# EAGLE design pcb_top (EAGLE 9.6.2)
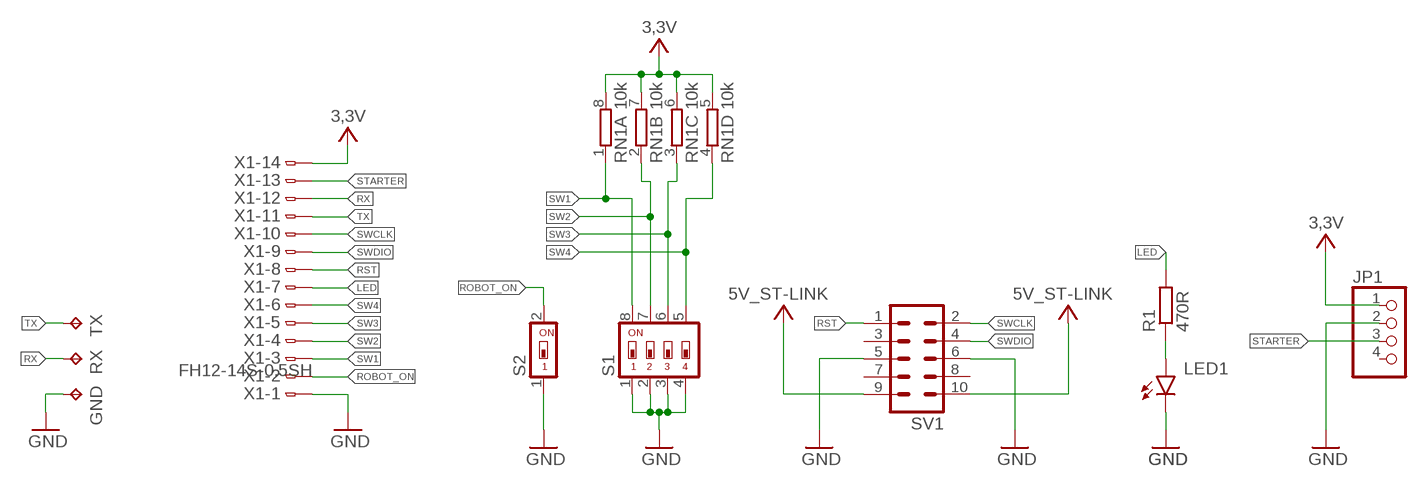
[diagram p0: schematic, sheet 1]

## Parts
GND  TPTP20SQ  [TP20SQ]
JP1  PINHD-1X4  [1X04]
LED1  LEDCHIP-LED0805  [CHIP-LED0805]
R1  470R  R-EU_R0603  [R0603]
RN1  10k  4R-NCAT16  [CAT16]
RX  TPTP20SQ  [TP20SQ]
S1  SWS004  [SMS-004]
S2  SWS001  [SMS-001]
SV1  ML10  [ML10]
TX  TPTP20SQ  [TP20SQ]
X1  FH12-14S-0.5SH  [FH12-14S-0.5SH]

## Nets
3,3V: JP1.1 RN1.5 RN1.6 RN1.7 RN1.8 X1.14 ; supply symbol labelled VCC
5V_ST-LINK: SV1.9 SV1.10 ; supply symbol labelled VCC
GND: GND.TP JP1.2 LED1.C S1.1 S1.2 S1.3 S1.4 S2.1 SV1.5 SV1.6 X1.1
LED: R1.2 X1.7
N$1: LED1.A R1.1
ROBOT_ON: S2.2 X1.2
RST: SV1.1 X1.8
RX: RX.TP X1.12
STARTER: JP1.3 X1.13
SW1: RN1.1 S1.8 X1.3
SW2: RN1.2 S1.7 X1.4
SW3: RN1.3 S1.6 X1.5
SW4: RN1.4 S1.5 X1.6
SWCLK: SV1.2 X1.10
SWDIO: SV1.4 X1.9
TX: TX.TP X1.11
Unconnected: JP1.4 SV1.3 SV1.7 SV1.8

## Library data of the parts
GND RX TX = testpad:TP: Test pad
JP1 = pinhead:PINHD-1X4: PIN HEADER
LED1 = led:LED: LED OSRAM: - CHIPLED LG R971, LG N971, LY N971, LG Q971, LY Q971, LO R971, LY R971 LH N974, LH R974 LS Q976, LO Q976, LY Q976 LO Q996 - Hyper CHIPLED LW Q18S LB Q993, LB Q99A, LB R99A - SideLED LS A670, LO A670, LY A670, LG A670, LP A670 LB A673, LV A673, LT A673, LW A673 LH A674 LY A675 LS A676, LA A676, LO A676, LY A676, LW A676 LS A679, LY A679, LG A679 - Hyper Micro SIDELED® LS Y876, LA Y876, LO Y876, LY Y876 LT Y87S - SmartLED LW L88C, LW L88S LB L89C, LB L89S, LG L890 LS L89K, LO L89K, LY L89K LS L896, LA L896, LO L896, LY L896 - TOPLED LS T670, LO T670, LY T670, LG T670, LP T670 LSG T670, LSP T670, LSY T670, LOP T670, LYG T670 LG T671, LOG T671, LSG T671 LB T673, LV T673, LT T673, LW T673 LH T674 LS T676, LA T676, LO T676, LY T676, LB T676, LH T676, LSB T676, LW T676 LB T67C, LV T67C, LT T67C, LS T67K, LO T67K, LY T67K, LW E67C LS E67B, LA E67B, LO E67B, LY E67B, LB E67C, LV E67C, LT E67C LW T67C LS T679, LY T679, LG T679 LS T770, LO T770, LY T770, LG T770, LP T770 LB T773, LV T773, LT T773, LW T773 LH T774 LS E675, LA E675, LY E675, LS T675 LS T776, LA T776, LO T776, LY T776, LB T776 LHGB T686 LT T68C, LB T68C - Hyper Mini TOPLED® LB M676 - Mini TOPLED Santana® LG M470 LS M47K, LO M47K, LY M47K Source: http://www.osram.convergy.de LUXEON: - LUMILED® LXK2-PW12-R00, LXK2-PW12-S00, LXK2-PW14-U00, LXK2-PW14-V00 LXK2-PM12-R00, LXK2-PM12-S00, LXK2-PM14-U00 LXK2-PE12-Q00, LXK2-PE12-R00, LXK2-PE12-S00, LXK2-PE14-T00, LXK2-PE14-U00 LXK2-PB12-K00, LXK2-PB12-L00, LXK2-PB12-M00, LXK2-PB14-N00, LXK2-PB14-P00, LXK2-PB14-Q00 LXK2-PR12-L00, LXK2-PR12-M00, LXK2-PR14-Q00, LXK2-PR14-R00 LXK2-PD12-Q00, LXK2-PD12-R00, LXK2-PD12-S00 LXK2-PH12-R00, LXK2-PH12-S00 LXK2-PL12-P00, LXK2-PL12-Q00, LXK2-PL12-R00 Source: www.luxeon.com KINGBRIGHT: KA-3528ASYC Source: www.kingbright.com
R1 = rcl:R-EU_: RESISTOR, European symbol; SPICEPREFIX: R
RN1 = resistor-dil:4R-N: Array Chip Resistor Source: RS Component / Phycomp; OC_FARNELL: unknown; OC_NEWARK: unknown
S1 = smd-special:SWS004: SMD Dip Switch 4 pol.
S2 = smd-special:SWS001: SMD Dip Switch 1 pol.
SV1 = con-harting-ml:ML10: HARTING; OC_FARNELL: unknown; OC_NEWARK: unknown
X1 = con-hirose:FH12-14S-0.5S: 0.5mm Pitch Connectors For FPC/FFC Source: Data sheet <http://www.hirose.co.jp/cataloge_hp/e58605370.pdf>; MPN: MC34827; OC_FARNELL: 1324544; OC_NEWARK: 41P0493

## Board
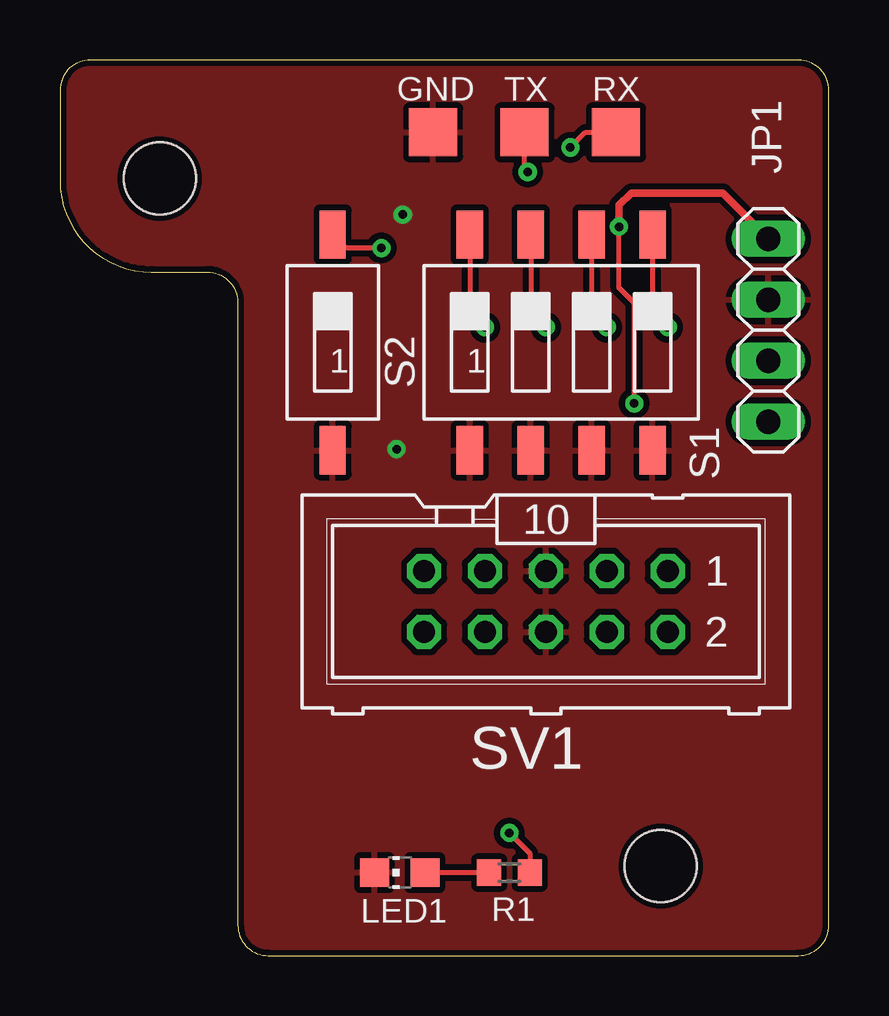
[diagram p1: board, top side]
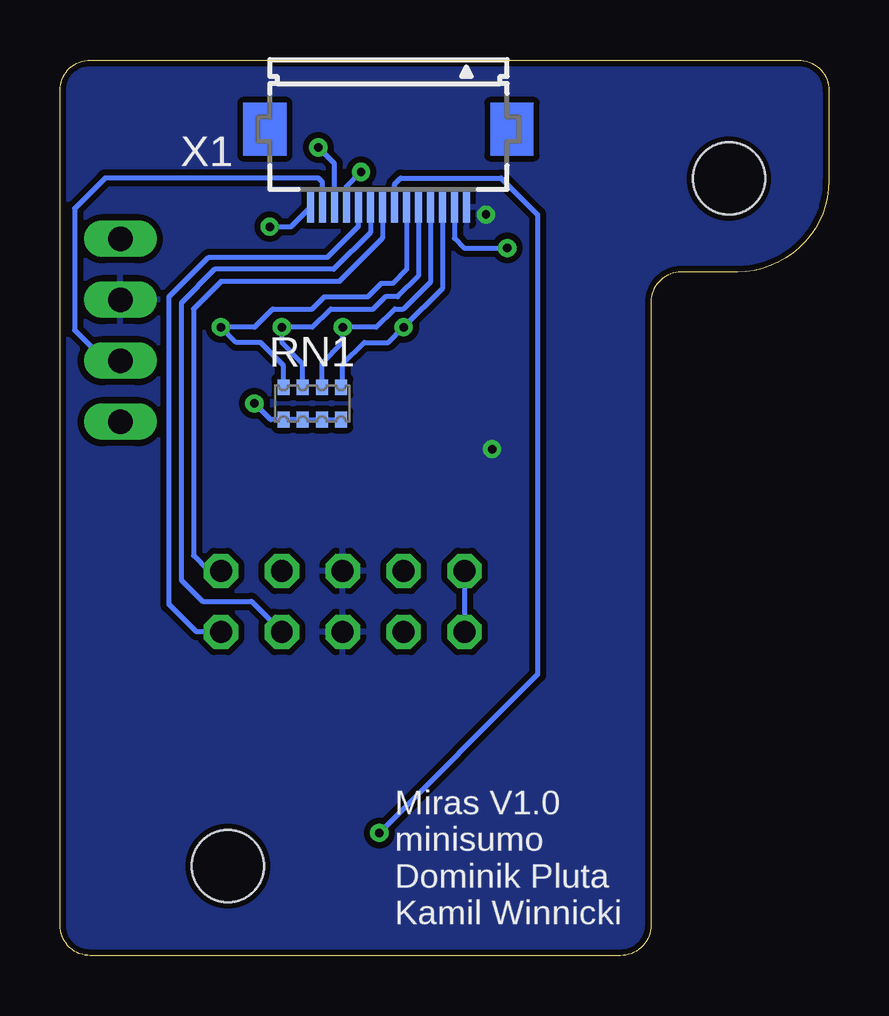
[diagram p2: board, bottom side, seen from below]

Size 32.05 x 37.34 mm. Coordinates in mm from the lower left corner, seen from the top.
Outline: 7.41,27.23 7.41,1.27 arc90 8.68,0 30.78,0 arc90 32.05,1.27 32.05,36.07 arc90 30.78,37.34 1.27,37.34 arc90 0,36.07 0,32.31 arc90 3.81,28.5 6.14,28.5 arc-90 7.41,27.23
Copper layers (1*16): Top 0.035mm / dielectric 1.5mm / Bottom 0.035mm
Design rules "default *": minimum track width 6mil, minimum drill 0.35mm, track to track 6mil, track to pad 6mil, pad to pad 6mil, via to via 6mil, smd to smd 6mil, copper to edge 1mil, drill to drill 6mil, minimum pad ring 10mil, minimum via ring 8mil, stop-mask expansion 4mil, vias tented up to drill 14mil, thermal gap 10mil
Holes 3 mm at 25.05,3.73 4.16,32.39
tKeepout: area 22,0.7 to 28,6.7; area 1.1,29.4 to 7.1,35.4

### Footprints (pad centres in the part's own frame; a part is rotated, then mirrored left to right if it is on the bottom)
TP20SQ = smd 2 x 2: TP 0,0
1X04 = drill 1.016 long: 1 -3.81,0; 2 -1.27,0; 3 1.27,0; 4 3.81,0
CHIP-LED0805 = smd 1.2 x 1.2: A 0,-1.05; C 0,1.05
R0603 = smd 1 x 1.1: 1 -0.85,0; 2 0.85,0
CAT16 = smd 0.5 x 0.65: 1 -1.2,-0.675; 2 -0.4,-0.675; 3 0.4,-0.675; 4 1.2,-0.675; 5 1.2,0.675; 6 0.4,0.675; 7 -0.4,0.675; 8 -1.2,0.675
SMS-004 = smd 1.092 x 2.007: 1 -3.81,-4.496; 2 -1.27,-4.496; 3 1.27,-4.496; 4 3.81,-4.496; 5 3.81,4.496; 6 1.27,4.496; 7 -1.27,4.496; 8 -3.81,4.496
SMS-001 = smd 1.092 x 2.007: 1 0,-4.496; 2 0,4.496
ML10 = drill 0.914 octagon: 1 -5.08,-1.27; 2 -5.08,1.27; 3 -2.54,-1.27; 4 -2.54,1.27; 5 0,-1.27; 6 0,1.27; 7 2.54,-1.27; 8 2.54,1.27; 9 5.08,-1.27; 10 5.08,1.27
FH12-14S-0.5SH = smd 0.3 x 1.3: 1 -3.25,3.25; 2 -2.75,3.25; 3 -2.25,3.25; 4 -1.75,3.25; 5 -1.25,3.25; 6 -0.75,3.25; 7 -0.25,3.25; 8 0.25,3.25; 9 0.75,3.25; 10 1.25,3.25; 11 1.75,3.25; 12 2.25,3.25; 13 2.75,3.25; 14 3.25,3.25

### Placement (x,y rotation side)
GND  15.56,34.32 0 top
JP1  29.53,26.07 270 top
LED1  14.16,3.46 90 top
R1  18.74,3.46 0 top
RN1  21.53,23.02 180 bottom
RX  23.18,34.32 0 top
S1  20.89,25.56 0 top
S2  11.37,25.56 0 top
SV1  20.26,14.76 180 top
TX  19.37,34.32 0 top
X1  18.35,34.45 180 bottom

### Tracks (layer width: path | path; a pad name or v marks a point on that pad's centre or on a via)
3,3V  (via drill 0.35)
  Top 0.203: v23.31,30.39 23.31,27.85 23.94,27.21 v23.94,23.02
  Top 0.305: JP1.1 27.63,31.78 23.82,31.78 23.31,31.28 v23.31,30.39
  Bottom 0.203: RN1.8 20.64,22.35 RN1.7 RN1.6 RN1.5 23.27,22.35 v23.94,23.02 | v23.31,30.39 22.42,30.39 X1.14
5V_ST-LINK
  Bottom 0.203: SV1.9 SV1.10
GND  (via drill 0.35)
  other vias: 14.04,21.12 14.29,30.89
  pour Top (isolate 0.254): -0.06,37.62 32.32,37.62 32.32,-0.47 6.92,-0.47 6.92,23.02 -0.06,30.01
  pour Bottom (isolate 0.254): -0.06,37.62 32.32,37.62 32.32,-0.47 6.92,-0.47 6.92,22.39 -0.06,29.37
LED  (via drill 0.35)
  Top 0.203: v18.74,5.11 19.59,4.26 R1.2
  Bottom 0.203: X1.7 18.1,32.16 17.85,32.42 13.66,32.42 12.13,30.9 12.13,11.71 v18.74,5.11
N$1
  Top 0.203: LED1.A R1.1
ROBOT_ON  (via drill 0.35)
  Top 0.203: v13.4,29.5 11.93,29.5 S2.2
  Bottom 0.203: X1.2 15.6,29.91 15.2,29.5 v13.4,29.5
RST
  Bottom 0.203: X1.8 18.6,29.91 20.41,28.1 25.34,28.1 26.48,26.96 26.48,16.67 25.85,16.04 SV1.1
RX  (via drill 0.35)
  Top 0.203: v21.28,33.69 21.91,34.32 RX.TP
  Bottom 0.203: X1.12 20.6,33.02 v21.28,33.69
STARTER
  Bottom 0.203: X1.13 21.1,32.25 21.28,32.42 30.17,32.42 31.44,31.15 31.44,26.07 30.17,24.8 JP1.3
SW1  (via drill 0.35)
  Top 0.203: S1.8 17.08,26.83 v17.72,26.2
  Bottom 0.203: X1.3 16.1,27.81 v17.72,26.2 18.35,25.56 19.37,25.56 20.26,24.67 20.26,23.77 RN1.1
SW2  (via drill 0.35)
  Top 0.203: 19.62,29.37 S1.7 19.62,26.83 v20.26,26.2
  Bottom 0.203: X1.4 16.6,28.07 17.72,26.96 18.1,26.96 18.86,26.2 v20.26,26.2 20.26,25.56 21.13,24.69 RN1.2
SW3  (via drill 0.35)
  Top 0.203: S1.6 22.16,26.83 v22.8,26.2
  Bottom 0.203: X1.5 17.1,28.33 17.97,27.46 18.48,27.46 18.99,26.96 20.77,26.96 21.53,26.2 v22.8,26.2 22.8,25.56 21.93,24.69 RN1.3
SW4  (via drill 0.35)
  Top 0.203: S1.5 24.7,26.83 v25.34,26.2
  Bottom 0.203: X1.6 17.59,31.19 17.59,28.61 18.18,28.02 18.65,28.02 19.21,27.46 21.02,27.46 21.53,26.96 23.18,26.96 23.94,26.2 v25.34,26.2 24.7,25.56 23.69,25.56 22.73,24.6 RN1.4
SWCLK
  Bottom 0.203: SV1.2 26.36,13.49 27.5,14.64 27.5,27.46 25.85,29.12 20.89,29.12 19.6,30.41 X1.10
SWDIO
  Bottom 0.203: X1.9 19.1,30.14 20.64,28.61 25.59,28.61 26.99,27.21 26.99,15.65 26.1,14.76 24.07,14.76 SV1.4
TX  (via drill 0.35)
  Top 0.203: v19.5,32.67 19.37,32.8 TX.TP
  Bottom 0.203: X1.11 20.1,32.06 v19.5,32.67

### Text on the board
bNames: Miras V1.0 / minisumo / Dominik Pluta / Kamil Winnicki